# EAGLE design untitled (EAGLE 9.6.2)
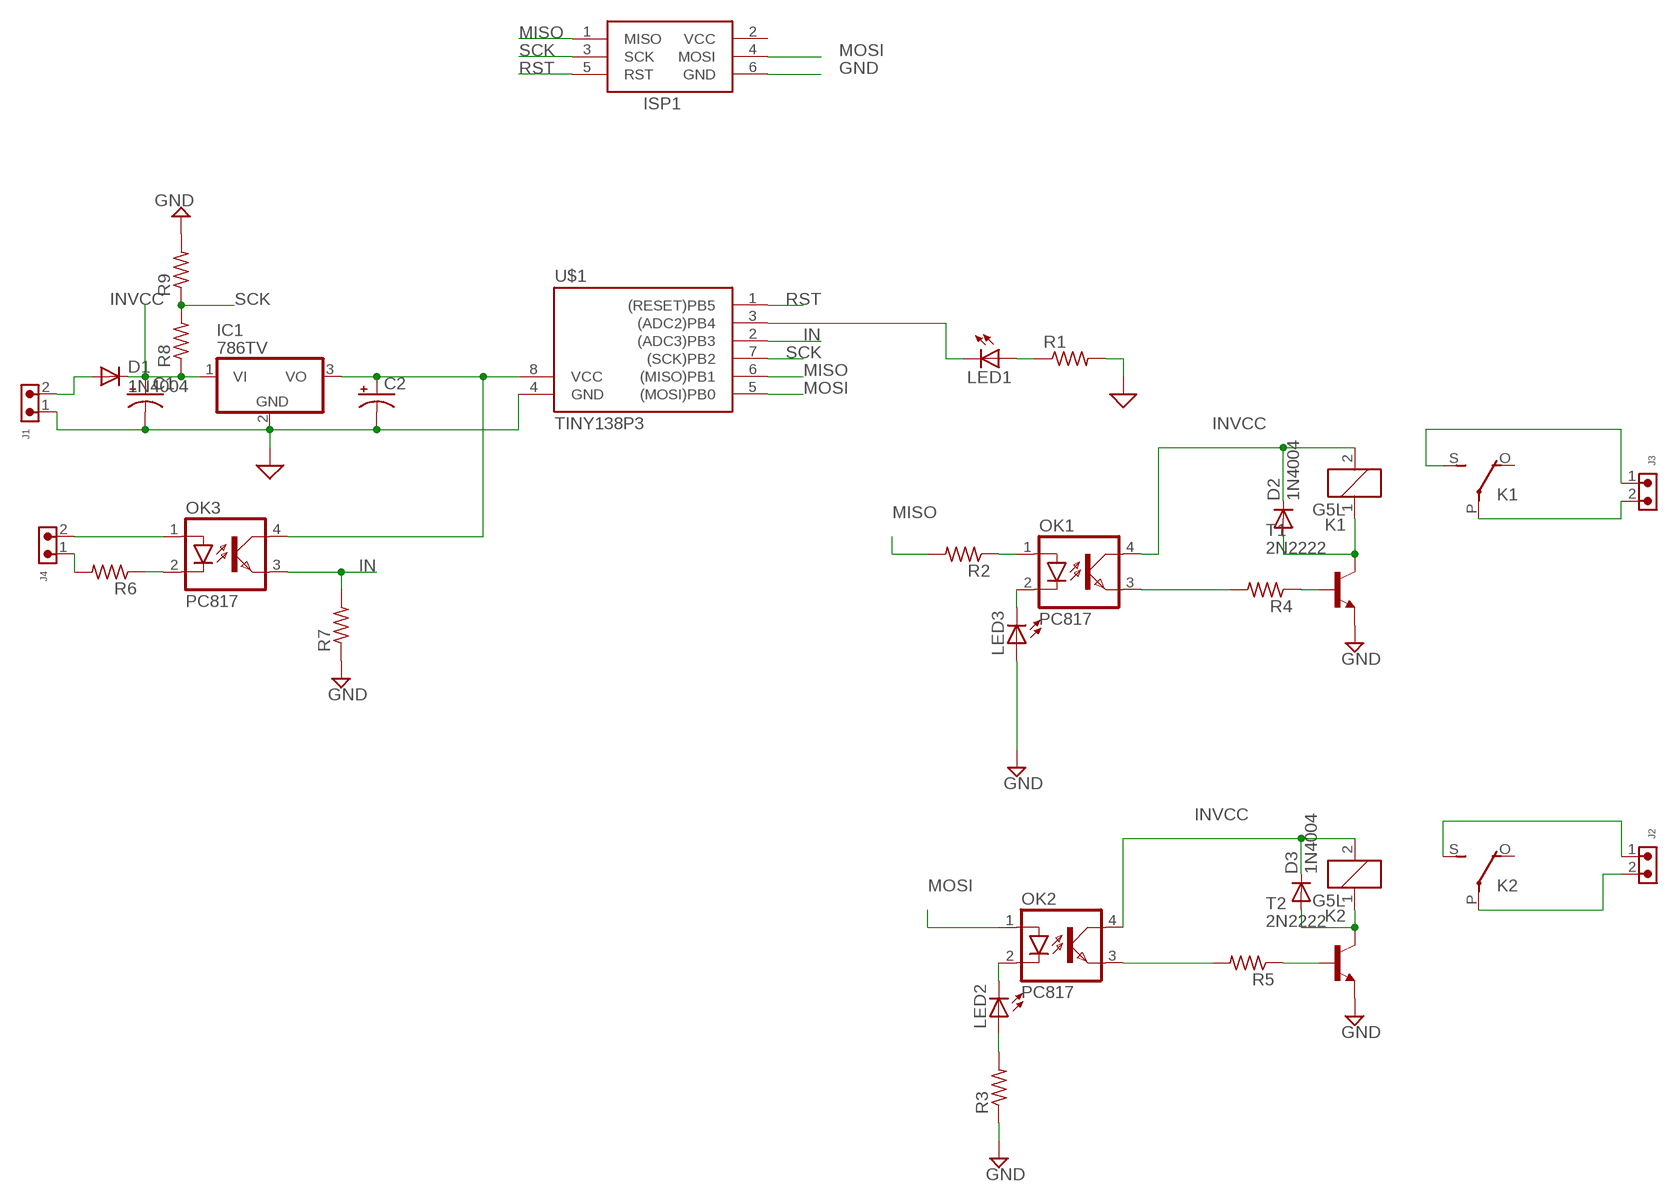
[diagram p0: schematic, sheet 1]

## Parts
C1  CAPACITOR-PE7.5-16  [E7,5-16]
C2  CAPACITOR-PE2,5-6E  [E2,5-6E]
D1  1N4004  [DO41-10]
D2  1N4004  [DO41-10]
D3  1N4004  [DO41-10]
IC1  786TV  [TO220V]
ISP1  AVRISP-6  [AVRISP]
J1  691305530002  [691305530002]
J2  691305530002  [691305530002]
J3  691305530002  [691305530002]
J4  691305530002  [691305530002]
K1  G5L  [G5LE]
K2  G5L  [G5LE]
LED1  LED5MM  [LED5MM]
LED2  LED5MM  [LED5MM]
LED3  LED5MM  [LED5MM]
OK1  PC817  [DIL04]
OK2  PC817  [DIL04]
OK3  PC817  [DIL04]
R1  R-US_0207/15  [0207/15]
R2  R-US_0207/7  [0207/7]
R3  R-US_0207/7  [0207/7]
R4  R-US_0207/9  [0207/9]
R5  R-US_0207/9  [0207/9]
R6  R-US_0207/7  [0207/7]
R7  R-US_0207/12  [0207/12]
R8  R-US_0207/7  [0207/7]
R9  R-US_0207/7  [0207/7]
T1  2N2222  [TO92-EBC-OVAL]
T2  2N2222  [TO92-EBC-OVAL]
U$1  TINY138P3  [DIL08]

## Nets
GND: C1.- C2.- IC1.2(GND) ISP1.6(GND) J1.1 LED3.A R1.2 R3.1 R7.1 R9.2 T1.E T2.E U$1.4(GND) ; supply symbol labelled SUP
IN: OK3.3(EMIT) R7.2 U$1.2((ADC3)PB3)
INVCC: C1.+ D1.C D2.C D3.C IC1.1(VI) K1.2 K2.2 OK1.4(COL) OK2.4(COL) R8.1
MISO: ISP1.1(MISO) R2.2 U$1.6((MISO)PB1)
MOSI: ISP1.4(MOSI) OK2.1(A) U$1.5((MOSI)PB0)
N$1: LED3.K(C) OK1.2(C)
N$2: LED1.A R1.1
N$3: D1.A J1.2
N$4: C2.+ IC1.3(VO) OK3.4(COL) U$1.8(VCC)
N$5: LED2.A R3.2
N$6: OK1.1(A) R2.1
N$7: OK2.3(EMIT) R5.2
N$8: LED2.K(C) OK2.2(C)
N$9: R4.1 T1.B
N$10: R5.1 T2.B
N$11: J2.2 K2.P(2:P)
N$12: D3.A K2.1 T2.C
N$13: D2.A K1.1 T1.C
N$14: J2.1 K2.S(2:S)
N$15: J3.2 K1.P(2:P)
N$16: J3.1 K1.S(2:S)
N$17: J4.2 OK3.1(A)
N$18: OK3.2(C) R6.1
N$19: J4.1 R6.2
N$21: OK1.3(EMIT) R4.2
N$22: LED1.K(C) U$1.3((ADC2)PB4)
RST: ISP1.5(RST) U$1.1((RESET)PB5)
SCK: ISP1.3(SCK) R8.2 R9.1 U$1.7((SCK)PB2)
Unconnected: K1.O(2:O) K2.O(2:O)

## Power pins joined to a net without a drawn wire
VCC: ISP1.2(VCC)

## Library data of the parts
C1 C2 = BeagleBone_Blue_R3:CAPACITOR-P: POLARIZED CAPACITOR, American symbol
D1-D3 = adafruit:1N4004: DIODE General purpose 1N400x type rectifier (With bigger pads) http://www.ladyada.net/library/pcb/eaglelibrary.html
IC1 = linear:78*: Positive VOLTAGE REGULATOR Source: http://cache.national.com/ds/LM/LM78L05.pdf http://www.fairchildsemi.com/ds/LM/LM7805.pdf
ISP1 = adafruit:AVRISP: AVR ISP HEADER Standard 6 pin header for AVR programming
J1-J4 = Wurth_Connectors_WR-TBL Pluggable Connector:691305530002: WR-TBL Serie 3055 - 5,08 mm - PCB Header Vertical Entry with Plastic Latches KIND PROPERTIES Pitch 5.08 mm MATERIAL PROPERTIES Insulator Material PA66 Insulator Flammability Rating UL94 V-0 Insulator Color Green Terminal Material Copper Alloy Terminal Plating Tin-plated surface GENERAL INFORMATION Operating Temperature -40 up to +105 °C ELECTRICAL PROPERTIES IR UL 16 A Working Voltage [UL] 300 V (AC) Withstanding Voltage [UL] 2500 V (AC) Contact Resistance [UL] 20 mΩ CERTIFICATION UL Approval E315414 <https://www.we-online.com/catalog/media/o135349v209%20Family_WR-TBL3_6913055300xx.jpg> Details see: https://www.we-online.com/catalog/en/TBL_5_08_3055_6913055300XX/ Updated by Ella Wu 2019-12-30 2019(C) Wurth Elektronik; DATASHEET-URL: https://www.we-online.com/catalog/datasheet/691305530002.pdf; IR-UL: 16A; MOUNT: THT; PART-NUMBER: 691305530002; PINS: 2; PITCH: 5.08mm; TYPE: Vertical; WORKING-VOLTAGE-UL: 300V (AC)
K1 K2 = relay:G5L: RELAY 1 x switch, 10 A/120 V AC, 8 A/30 V ADC, Omron; OC_FARNELL: unknown; OC_NEWARK: unknown
LED1-LED3 = adafruit:LED: LED OSRAM: - CHIPLED LG R971, LG N971, LY N971, LG Q971, LY Q971, LO R971, LY R971 LH N974, LH R974 LS Q976, LO Q976, LY Q976 LO Q996 - Hyper CHIPLED LW Q18S LB Q993, LB Q99A, LB R99A - SideLED LS A670, LO A670, LY A670, LG A670, LP A670 LB A673, LV A673, LT A673, LW A673 LH A674 LY A675 LS A676, LA A676, LO A676, LY A676, LW A676 LS A679, LY A679, LG A679 - Hyper Micro SIDELED® LS Y876, LA Y876, LO Y876, LY Y876 LT Y87S - SmartLED LW L88C, LW L88S LB L89C, LB L89S, LG L890 LS L89K, LO L89K, LY L89K LS L896, LA L896, LO L896, LY L896 - TOPLED LS T670, LO T670, LY T670, LG T670, LP T670 LSG T670, LSP T670, LSY T670, LOP T670, LYG T670 LG T671, LOG T671, LSG T671 LB T673, LV T673, LT T673, LW T673 LH T674 LS T676, LA T676, LO T676, LY T676, LB T676, LH T676, LSB T676, LW T676 LB T67C, LV T67C, LT T67C, LS T67K, LO T67K, LY T67K, LW E67C LS E67B, LA E67B, LO E67B, LY E67B, LB E67C, LV E67C, LT E67C LW T67C LS T679, LY T679, LG T679 LS T770, LO T770, LY T770, LG T770, LP T770 LB T773, LV T773, LT T773, LW T773 LH T774 LS E675, LA E675, LY E675, LS T675 LS T776, LA T776, LO T776, LY T776, LB T776 LHGB T686 LT T68C, LB T68C - Hyper Mini TOPLED® LB M676 - Mini TOPLED Santana® LG M470 LS M47K, LO M47K, LY M47K Source: http://www.osram.convergy.de/
OK1-OK3 = optocoupler:PC817: SHARP OPTO COUPLER; MPN: PC817X4J000F; OC_FARNELL: 9707727; OC_NEWARK: 97K7059
R1 R3-R5 R7 = adafruit:R-US_: RESISTOR, American symbol
R2 R6 R8 R9 = BeagleBone_Black_Wireless:R-US_: RESISTOR, American symbol
T1 T2 = adafruit:2N2222: NPN TRANSISTOR Big oval pads
U$1 = avr-7:TINY13*

## Board
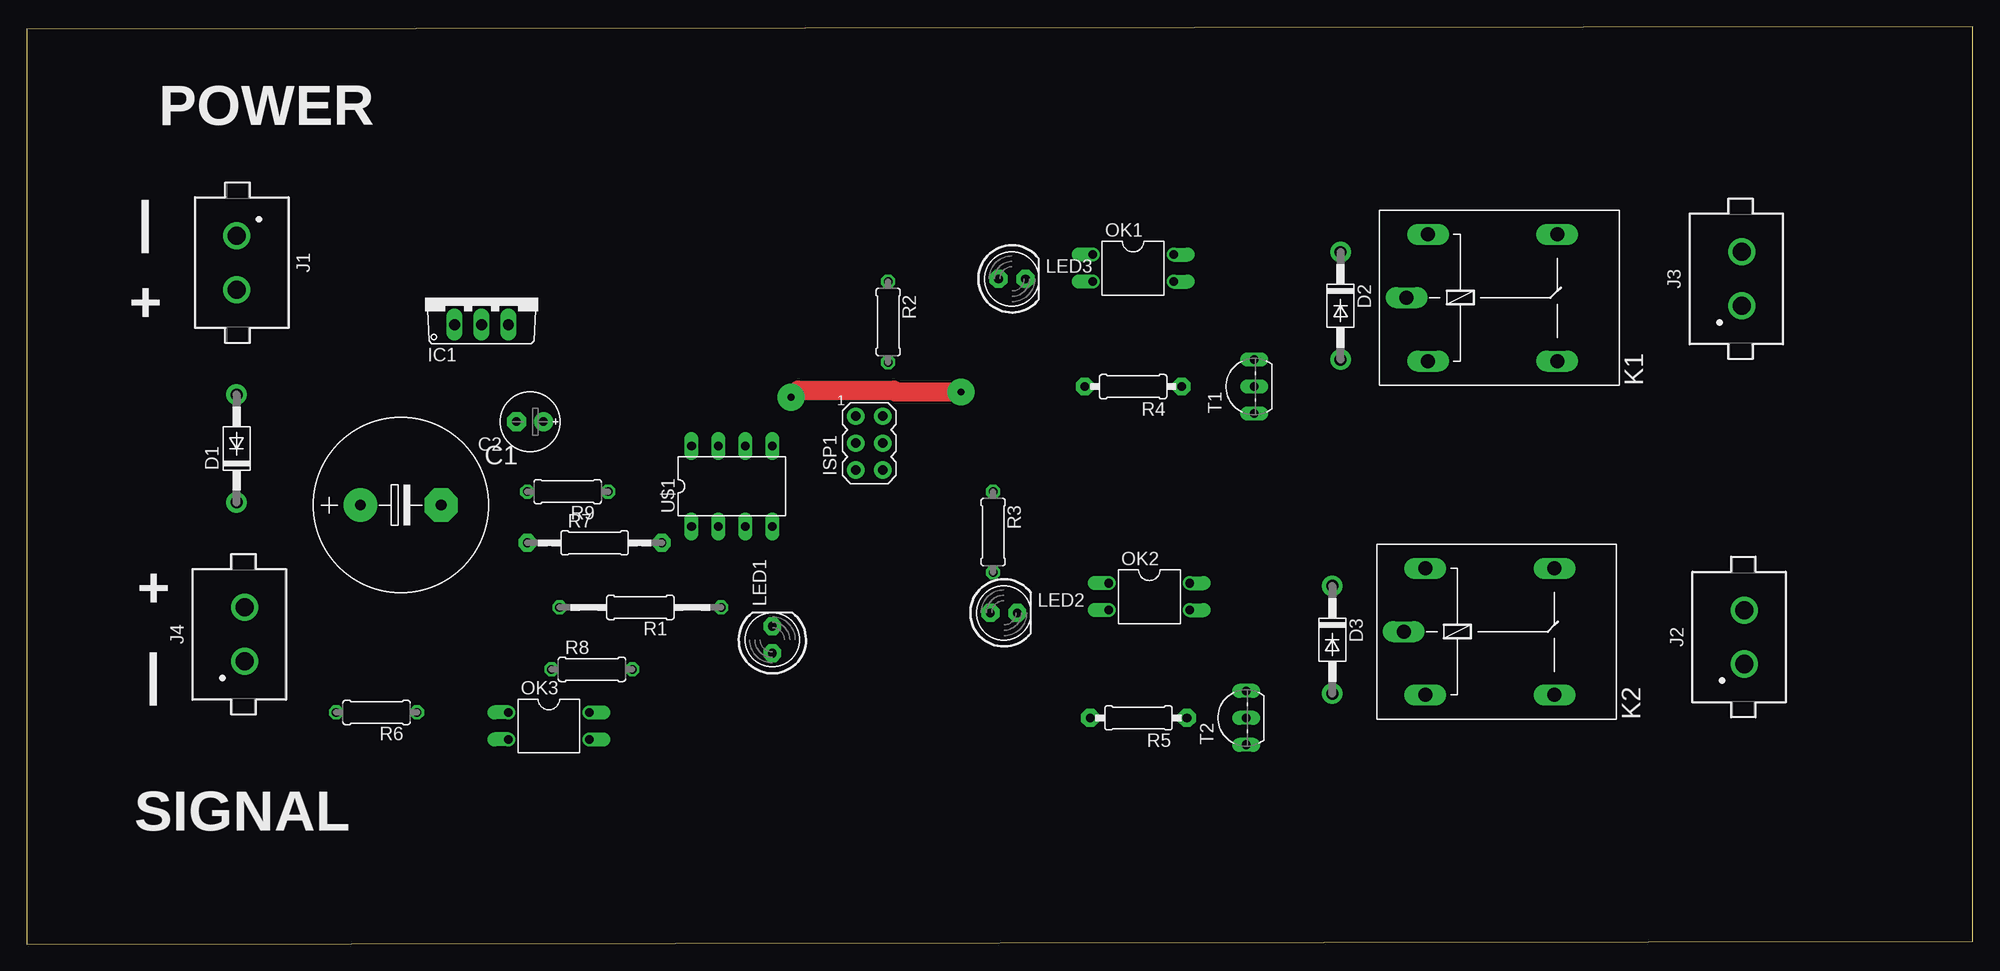
[diagram p1: board, top side]
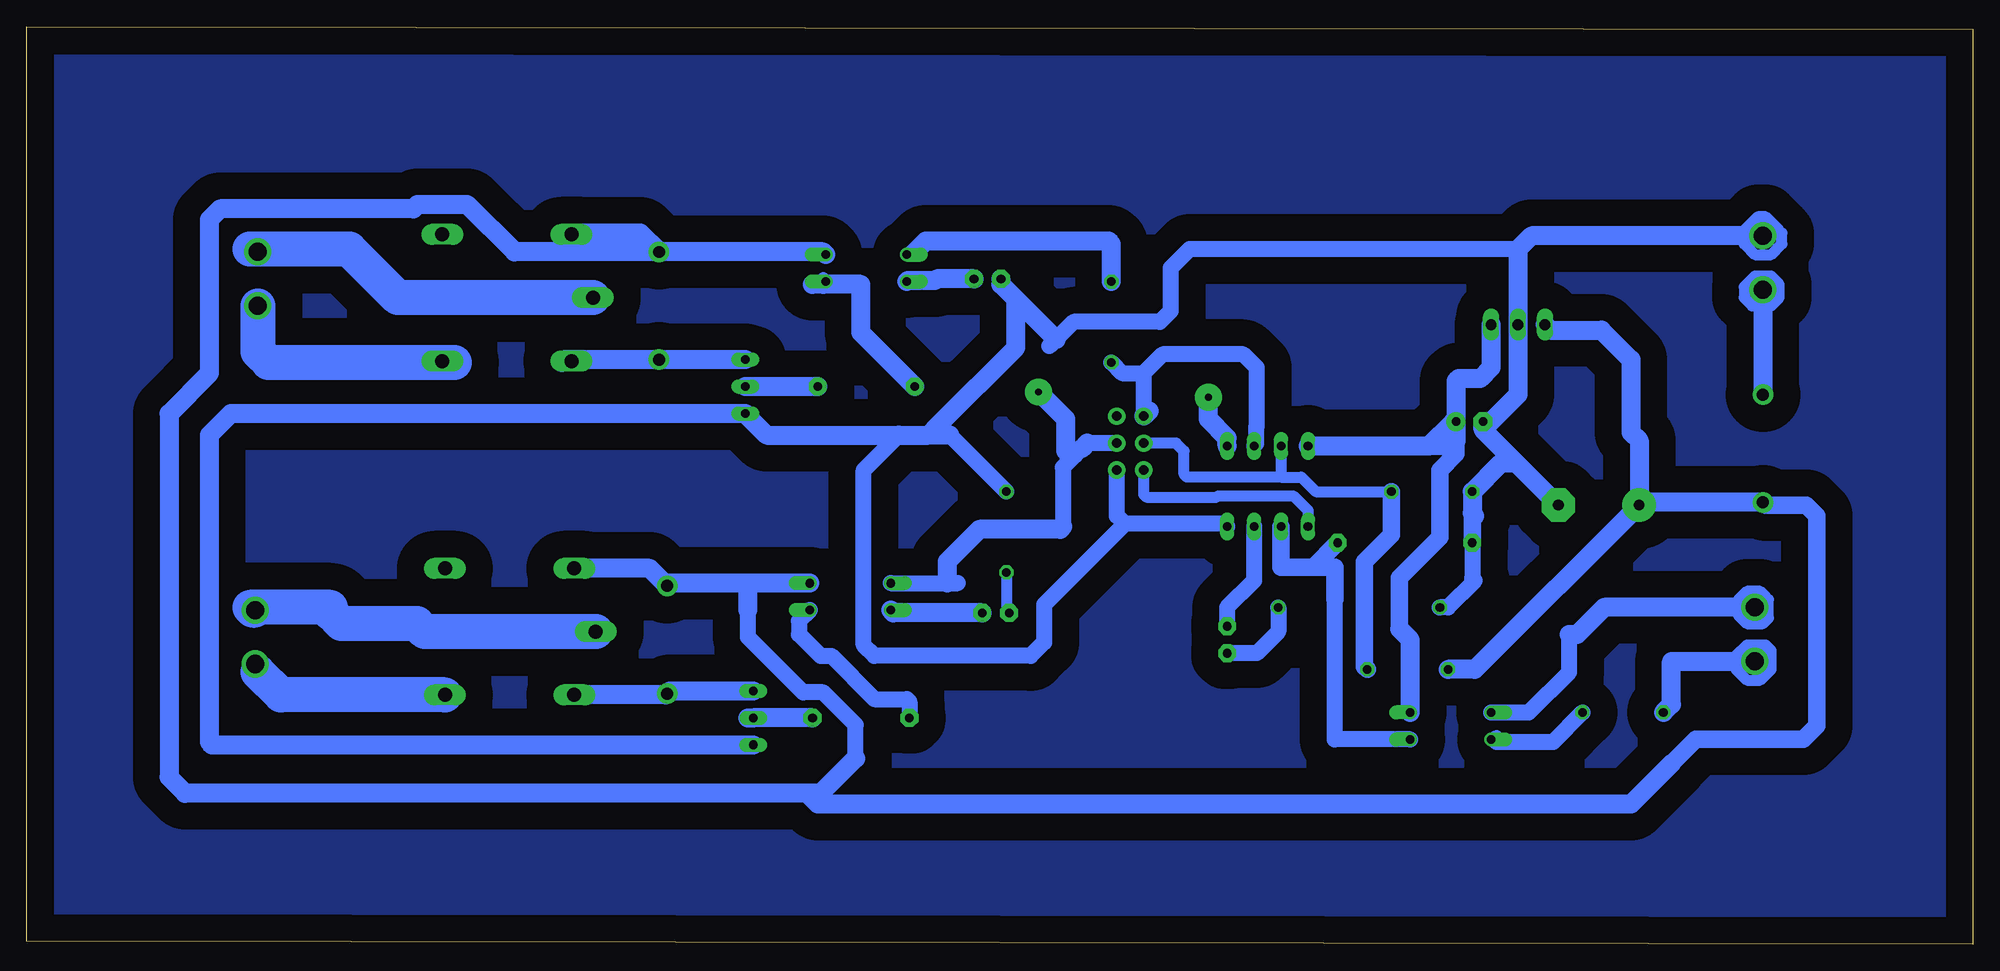
[diagram p2: board, bottom side, seen from below]

Size 183.62 x 86.54 mm. Coordinates in mm from the lower left corner, seen from the top.
Outline: 0,0 183.62,0.25 183.62,86.54 0,86.28 0,0
Copper layers (1*16): Top 0.035mm / dielectric 1.5mm / Bottom 0.035mm
Design rules "default *": minimum track width 40mil, minimum drill 0.35mm, track to track 30mil, track to pad 30mil, pad to pad 6mil, via to via 6mil, smd to smd 6mil, copper to edge 40mil, drill to drill 6mil, minimum pad ring 10mil, minimum via ring 8mil, stop-mask expansion 4mil, vias tented up to drill 0mil, thermal gap 10mil

### Footprints (pad centres in the part's own frame; a part is rotated, then mirrored left to right if it is on the bottom)
E7,5-16 = drill 1.016 pad 3.15: + -3.81,0 | drill 1.016 pad 3.15 octagon: - 3.81,0
E2,5-6E = drill 0.813 pad 1.778: + -1.27,0 | drill 0.813 pad 1.778 octagon: - 1.27,0
DO41-10 = drill 1.118 pad 1.93: A 5.08,0; C -5.08,0
TO220V = drill 1.016 long: 1 -2.54,-2.54; 2 0,-2.54; 3 2.54,-2.54
AVRISP = drill 0.9 pad 1.626: 1 -1.27,2.54; 2 1.27,2.54; 3 -1.27,0; 4 1.27,0; 5 -1.27,-2.54; 6 1.27,-2.54
691305530002 = drill 1.7: 1 -2.54,0; 2 2.54,0
G5LE = drill 1.321 long: 1 -7.493,-5.969; 2 -7.493,5.969; O 4.699,5.969; P -9.525,0; S 4.699,-5.969
LED5MM = drill 0.813 pad 1.676 octagon: A -1.27,0; K 1.27,0
DIL04 = drill 0.813 offset: 1 -1.27,-3.81; 2 1.27,-3.81; 3 1.27,3.81; 4 -1.27,3.81
0207/15 = drill 0.813 octagon: 1 -7.62,0; 2 7.62,0
0207/7 = drill 0.813 octagon: 1 -3.81,0; 2 3.81,0
0207/9 = drill 0.813 pad 1.676 octagon: 1 -4.572,0; 2 4.572,0
0207/12 = drill 0.813 pad 1.676 octagon: 1 -6.35,0; 2 6.35,0
TO92-EBC-OVAL = drill 0.813 long: B 0,-1.27; C 2.54,-1.27; E -2.54,-1.27
DIL08 = drill 0.813 long: 1 -3.81,-3.81; 2 -1.27,-3.81; 3 1.27,-3.81; 4 3.81,-3.81; 5 3.81,3.81; 6 1.27,3.81; 7 -1.27,3.81; 8 -3.81,3.81

### Placement (x,y rotation side)
C1  35.31,41.4 0 top
C2  47.5,49.28 180 top
D1  19.81,46.74 90 top
D2  123.95,60.2 270 top
D3  123.19,28.7 270 top
IC1  42.93,60.96 0 top
ISP1  79.5,47.24 0 top
J1  19.81,64.26 270 top
J2  162.05,28.96 90 top
J3  161.8,62.74 90 top
J4  20.57,29.21 90 top
K1  139.7,60.96 0 top
K2  139.45,29.46 0 top
LED1  70.36,28.7 90 top
LED2  92.2,31.24 0 top
LED3  92.96,62.74 0 top
OK1  104.39,63.75 270 top
OK2  105.92,32.77 270 top
OK3  49.28,20.57 270 top
R1  57.91,31.75 180 top
R2  81.28,58.67 270 top
R3  91.19,38.86 270 top
R4  104.39,52.58 180 top
R5  104.9,21.34 180 top
R6  33.02,21.84 180 top
R7  53.59,37.85 0 top
R8  53.34,25.91 0 top
R9  51.05,42.67 180 top
T1  114.55,52.58 90 top
T2  113.79,21.34 90 top
U$1  66.55,43.18 0 top

### Tracks (layer width: path | path; a pad name or v marks a point on that pad's centre or on a via)
GND
  Bottom 1.016: 43.05,58.42 IC1.2
  Bottom 1.524: R7.1 47.24,34.54 46.99,34.29 49.53,31.75 R1.2 | 42.93,65.53 73.91,65.53 75.69,63.75 75.69,59.69 76.71,58.67 84.84,58.67 86.49,57.02 87.12,56.39 | U$1.4 70.61,39.62 80.01,39.62 | 80.01,39.62 80.77,40.39 ISP1.6 | 80.01,39.62 87.63,32 87.63,28.45 88.9,27.18 103.63,27.18 104.65,28.19 104.65,44.7 101.35,48.01 | R3.1 97.54,49.02
  Bottom 1.651: 47.24,40.64 R7.1
  Bottom 1.778: J1.1 41.66,66.8 42.93,65.53 IC1.2 | IC1.2 42.93,57.15 | C1.- 43.05,45.34 | 43.05,45.34 46.23,48.51 | 46.23,48.51 C2.- | IC1.2 42.93,51.82 46.23,48.51 | 43.05,45.34 44.58,45.34 R9.2 47.24,40.64 46.99,40.39 | T2.E 166.12,18.8 166.37,19.05 166.37,48.01 164.34,50.04 T1.E 113.79,48.01 101.35,48.01 98.55,48.01 | LED3.A 91.69,62.23 90.3,60.83 | 90.3,60.83 86.49,57.02 | 98.55,48.01 97.54,49.02 90.3,56.26 90.3,60.83 | 96.52,48.01 98.55,48.01
IN
  Bottom 1.524: OK3.3 60.2,19.3 60.2,32.51
  Bottom 1.651: 62.23,35.56 60.2,35.56 60.2,32.51 | 62.23,35.56 65.28,35.56 U$1.2 | R7.2 62.23,35.56
INVCC
  Bottom 1.016: K1.2 132.59,67.31 132.59,67.06
  Bottom 1.524: 105.41,17.53 105.41,20.69 108.47,23.75 110.36,23.75 115.57,28.96 115.57,31.5
  Bottom 1.651: D1.C 19.56,41.4 15.75,41.4 14.73,40.39 14.73,20.57 16,19.3 26.16,19.3 28.45,17.02
  Bottom 1.778: C1.+ 31.5,47.5 32.26,48.26 32.26,55.12 35.05,57.91 39.88,57.91 IC1.1 | D1.C 31.24,41.66 C1.+ | C1.+ 46.99,25.91 R8.1 | K2.2 124.84,35.43 D3.C 122.94,34.04 115.57,34.04 | OK1.4 108.46,65.28 D2.C | D2.C 125.73,67.06 132.59,67.06 132.84,67.06 | OK2.4 115.57,34.04 | D2.C 137.59,65.28 142.06,69.75 146.74,69.75 147.14,69.34 165.35,69.34 166.37,68.33 166.37,53.85 170.18,50.04 170.18,15.75 168.66,14.22 109.98,14.22 | 109.98,14.22 108.71,14.22 105.41,17.53 | 115.57,31.5 115.57,34.04 | 28.45,17.02 32.26,13.21 108.97,13.21 109.98,14.22
MISO
  Bottom 1.016: 77.91,50.1 77.98,50.16 ISP1.1
  Bottom 1.524: R2.2 80.26,53.85 78.23,53.85 | 78.23,53.85 ISP1.1 | U$1.6 67.61,47.19 67.61,48.77 67.56,48.82 67.56,54.36 68.83,55.63 76.45,55.63 78.23,53.85
  Bottom 1.778: 77.72,50.29 77.91,50.1 78.22,49.8
MOSI  (via drill 0.65 pad 2.54)
  Top 1.778: v88.14,52.07 81.97,52.07 81.79,52.25 72.82,52.25 v72.14,51.56
  Bottom 1.016: 85.6,46.48 84.96,46.36 84.71,46.1
  Bottom 1.524: OK2.1 96.77,34.04 95.76,34.04 | ISP1.4 83.57,47.24 | 85.85,39.37 85.85,44.96 84.71,46.1 84.07,46.74
  Bottom 1.778: U$1.5 70.36,47.75 72.14,49.53 v72.14,51.56 | v88.14,52.07 85.6,49.53 85.6,46.48 85.34,46.23 | 83.57,47.24 84.07,46.74 | 85.85,39.37 86.11,39.12 93.73,39.12 96.77,36.07 96.77,34.04
N$1
  Bottom 1.778: LED3.K 97.76,62.74 97.94,62.56 100.51,62.56 OK1.2
N$2
  Bottom 1.524: R1.1 65.53,29.46 67.56,27.43 LED1.A
N$3
  Bottom 1.778: J1.2 D1.A
N$4
  Bottom 1.651: 48.77,47.46 48.77,46.23 50.29,44.7 50.29,38.35 54.1,34.54 54.1,29.72
  Bottom 1.778: IC1.3 45.47,54.36 46.48,53.34 48.51,53.34 48.77,53.09 C2.+ 49.02,49.28 | U$1.8 51.31,46.99 | 51.31,46.99 49.02,49.28 | OK3.4 53.09,28.7 54.1,29.72 | 49.02,49.28 48.77,49.02 48.77,47.46 49.24,46.99 51.31,46.99
N$5
  Bottom 1.016: R3.2 91.19,31.5 LED2.A
N$6
  Bottom 1.016: OK1.1 100.2,65.41 99.82,65.28
  Bottom 1.778: R2.1 81.28,66.04 81.53,66.29 98.81,66.29 99.82,65.28
N$7
  Bottom 1.524: OK2.3 110.74,30.48 110.74,29.21 108.71,27.18 107.7,27.18 103.63,23.11 100.58,23.11 100.33,22.86 R5.2
N$8
  Bottom 1.778: LED2.K 101.85,31.24 OK2.2
N$9
  Bottom 1.778: R4.1 T1.B
N$10
  Bottom 1.778: R5.1 T2.B 115.57,21.34
N$11
  Bottom 3.302: K2.P 146.05,29.46 146.81,30.23 153.92,30.23 154.94,31.24 154.94,31.75 162.56,31.75 162.31,31.5 J2.2
N$12
  Bottom 1.778: K2.1 123.32,23.49 D3.A 122.94,23.88 T2.C
N$13
  Bottom 1.016: K1.1 132.59,55.25 132.59,55.12
  Bottom 1.778: T1.C D2.A 132.59,55.12 132.84,55.12 133.1,54.86
N$14
  Bottom 1.016: J2.1 162.43,26.67 161.8,25.65
  Bottom 3.302: K2.S 159.64,23.49 161.8,25.65
N$15
  Bottom 1.016: J3.2 161.8,65.53
  Bottom 3.302: K1.P 148.59,60.96 153.16,65.53 161.8,65.53 162.56,65.53
N$16
  Bottom 1.016: K1.S 144.65,55.25 144.65,54.86
  Bottom 3.302: J3.1 161.8,55.88 160.78,54.86 144.65,54.86 143.26,54.86
N$17
  Bottom 1.524: OK3.1 41.91,21.84 38.1,25.65 38.1,29.21
  Bottom 1.778: J4.2 34.8,31.75 37.34,29.21 38.1,29.21
N$18
  Bottom 1.016: OK3.2 44.96,19.69 44.96,19.05
  Bottom 1.524: R6.1 39.62,19.05 44.96,19.05
N$19
  Bottom 1.778: R6.2 28.45,22.61 28.45,26.67 J4.1
N$20
  pour Bottom (isolate 2.54): 1.78,85.09 182.12,85.09 182.12,1.27 1.78,1.27
N$21
  Bottom 1.016: OK1.3 108.46,62.87 108.46,62.23
  Bottom 1.778: R4.2 104.9,57.66 104.9,62.23 108.46,62.23 109.47,62.23
N$22
  Bottom 1.524: U$1.3 67.82,34.29 70.36,31.75 LED1.K
N$23
  Bottom 1.016: 18.29,67.31 19.56,68.58 20.32,68.58 21.59,67.31 21.59,66.04 20.57,65.02 19.05,65.02 18.03,66.04 18.03,67.06
N$24
  Bottom 1.016: 18.29,62.23 19.05,62.99 20.57,62.99 21.59,61.98 21.59,60.96 20.83,60.2 19.05,60.2 18.29,60.96 18.29,61.98
N$25
  Bottom 1.016: 19.56,32.77 20.07,33.27 21.34,33.27 22.1,32.51 22.1,30.99 21.34,30.23 19.81,30.23 19.3,30.73 19.3,32.51
N$26
  Bottom 1.016: 19.81,28.19 21.34,28.19 22.35,27.18 22.35,25.91 21.34,24.89 20.07,24.89 19.05,25.91 19.05,27.69 19.56,28.19
RST
  Bottom 1.016: U$1.1 62.74,40.89 64.11,42.27 71.22,42.27 71.32,42.16 77.98,42.16 78.23,42.42 ISP1.5
SCK
  Bottom 1.016: U$1.7 65.28,44.04 | 65.28,44.04 74.17,44.04 74.42,44.3 74.42,46.48 75.18,47.24 ISP1.3 | 65.28,44.04 63.37,44.04 62,42.67 R9.1
  Bottom 1.651: R8.2 57.4,26.16 57.4,36.07 54.86,38.61 R9.1

### Text on the board
tPlace: POWER | | | + | + | | | SIGNAL